# Altium schematic sheet AVR.SchDoc
size 420 x 297 mm; SheetNumber: 7; SheetTotal: 7
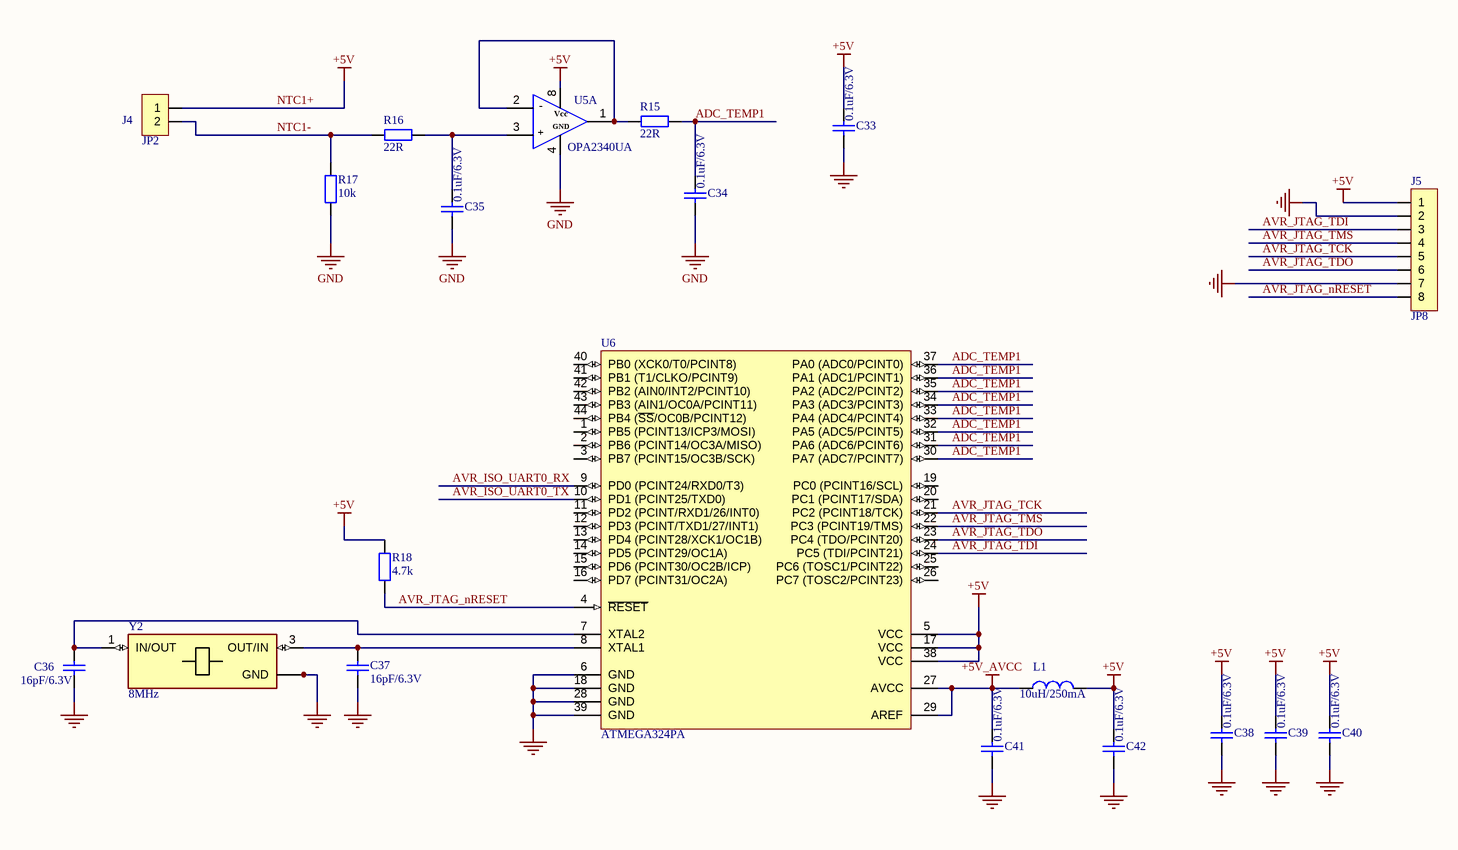
[diagram p0: AVR.SchDoc]

## Parts
C33  0.1uF/6.3V  [CAP_C_1608X80]
C34  0.1uF/6.3V  [CAP_C_1608X80]
C35  0.1uF/6.3V  [CAP_C_1608X80]
C36  16pF/6.3V  [CAP_C_1608X80]
C37  16pF/6.3V  [CAP_C_1608X80]
C38  0.1uF/6.3V  [CAP_C_1608X80]
C39  0.1uF/6.3V  [CAP_C_1608X80]
C40  0.1uF/6.3V  [CAP_C_1608X80]
C41  0.1uF/6.3V  [CAP_C_1608X80]
C42  0.1uF/6.3V  [CAP_C_1608X80]
J4  JP2  [JP2-D1T]
J5  JP8  [JP8-C1T]
L1  10uH/250mA  [RES_C_1608X60]
R15  22R  [RES_C_1608X60]
R16  22R  [RES_C_1608X60]
R17  10k  [RES_C_1608X60]
R18  4.7k  [RES_C_1608X60]
U5  OPA2340UA  [SOIC127P602X173-8N]  (part A of 2)
U6  ATMEGA324PA  [QFP80P1200X1200X120-44]
Y2  8MHz  [XTAL_ECS-250-12-33Q-JES-TR]

## Nets
+5V_AVCC: C41.1 L1.1 U6.27(AVCC) U6.29(AREF)
GND: C33.2 C34.2 C35.2 C36.1 C37.1 C38.2 C39.2 C40.2 C41.2 C42.2 J5.2 J5.7 R17.2 U5.4 U6.6(GND) U6.18(GND) U6.28(GND) U6.39(GND) Y2.2(GND) Y2.4(GND)
NTC1+: C33.1 C38.1 C39.1 C40.1 C42.1 J4.1 J5.1 L1.2 R18.2 U5.8 U6.5(VCC) U6.17(VCC) U6.38(VCC)  [also labelled +5V]
ADC_TEMP1: C34.1 R15.1 U6.30(PA7_(ADC7/PCINT7)) U6.31(PA6_(ADC6/PCINT6)) U6.32(PA5_(ADC5/PCINT5)) U6.33(PA4_(ADC4/PCINT4)) U6.34(PA3_(ADC3/PCINT3)) U6.35(PA2_(ADC2/PCINT2)) U6.36(PA1_(ADC1/PCINT1)) U6.37(PA0_(ADC0/PCINT0))
AVR_ISO_UART0_RX: U6.9(PD0_(PCINT24/RXD0/T3))
AVR_ISO_UART0_TX: U6.10(PD1_(PCINT25/TXD0))
AVR_JTAG_nRESET: J5.8 R18.1 U6.4(~{RESET})
AVR_JTAG_TCK: J5.5 U6.21(PC2_(PCINT18/TCK))
AVR_JTAG_TDI: J5.3 U6.24(PC5_(TDI/PCINT21))
AVR_JTAG_TDO: J5.6 U6.23(PC4_(TDO/PCINT20))
AVR_JTAG_TMS: J5.4 U6.22(PC3_(PCINT19/TMS))
NTC1-: J4.2 R16.2 R17.1
NetC35_1: C35.1 R16.1 U5.3
NetC36_2: C36.2 U6.7(XTAL2) Y2.1(IN/OUT)
NetC37_2: C37.2 U6.8(XTAL1) Y2.3(OUT/IN)
NetR15_2: R15.2 U5.1 U5.2

Not connected (* = marked no-connect by the designer): U6 1(PB5_(PCINT13/ICP3/MOSI)) 2(PB6_(PCINT14/OC3A/MISO)) 3(PB7_(PCINT15/OC3B/SCK)) 11(PD2_(PCINT/RXD1/26/INT0)) 12(PD3_(PCINT/TXD1/27/INT1)) 13(PD4_(PCINT28/XCK1/OC1B)) 14(PD5_(PCINT29/OC1A)) 15(PD6_(PCINT30/OC2B/ICP)) 16(PD7_(PCINT31/OC2A)) 19(PC0_(PCINT16/SCL)) 20(PC1_(PCINT17/SDA)) 25(PC6_(TOSC1/PCINT22)) 26(PC7_(TOSC2/PCINT23)) 40(PB0_(XCK0/T0/PCINT8)) 41(PB1_(T1/CLKO/PCINT9)) 42(PB2_(AIN0/INT2/PCINT10)) 43(PB3_(AIN1/OC0A/PCINT11)) 44(PB4_(~{SS}/OC0B/PCINT12))

## Notes on the sheet
- Sub-system:
- Project:
- Design by:
- Sheet title:
- Sheet
- of
- Checked by:
- Approved by:
- Doc No:
- Revision:
- Size:
- Date:
- A3
- (in symbol OPA2340UA/2K5, part A) -; Vcc; GND; +

## Library data of the parts
C33-C42 = Tu 0402 33nF 10V: CAPC; Chung_Loai: Dán; Don_Vi: Con; So_Chan: 2; Ten_Linh_Kien: Tụ 0402 33nF X7R 10V GRM155R71A333KA01D; Ma_Hang: MH007853; Kieu_Chan: *
J4 = JP2: WR-PHD 2.54 mm Angled Socket Header; Manufacturer: W¨¹rth Elektronik eiSos GmbH; partNo: 613002143121; ComponentLink1 Description: Manufacturer; ComponentLink2 Description: Datasheet; NoPins: 02; Created Date: 29 March 2013; ComponentLink1URL: http://www.we-online.com; ComponentLink2URL: http://katalog.we-online.de/em/datasheet/6130xx143121.pdf; Created by: Karrer Zheng
L1 = L-SMD-1: partNo: 78477010; Manufacturer: Wurth Elektronik; Inductance: 1.0 μH; ComponentLink1Description: Manufacturer; ComponentLink1URL: http://www.we-online.de; Created by: Baojun Chen; Created Date: Nov.2015; ComponentLink2Description: Datasheet; ComponentLink2URL: http://katalog.we-online.de/pbs/datasheet/78477010.pdf
R15-R18 = Tro 0603 1% 10k: RES; Chung_Loai: Dán; Don_Vi: Con; So_Chan: 2; Ten_Linh_Kien: Trở 0603 1% 10k; Ma_Hang: MH006333; Kieu_Chan: *
U5 = OPA2340UA/2K5
U6 = MCU_ATMEGA324PA
Y2 = ECS-250-12-33Q-JES-TR: 25 MHz Â±20ppm Crystal 12pF 40 Ohms 4-SMD, No Lead; MF: ECS Inc.; Value: *; Purchase-URL: https://pricing.snapeda.com/search/part/ECS-250-12-33Q-JES-TR/?ref=eda; Package: ECS-33B ECS Inc.; Availability: In Stock; SnapEDA_Link: https://www.snapeda.com/parts/ECS-250-12-33Q-JES-TR/ECS+Inc./view-part/?ref=snap; MP: ECS-250-12-33Q-JES-TR; Check_prices: https://www.snapeda.com/parts/ECS-250-12-33Q-JES-TR/ECS+Inc./view-part/?ref=eda; Price: None